# EAGLE design LoRa_final (EAGLE 9.6.2)
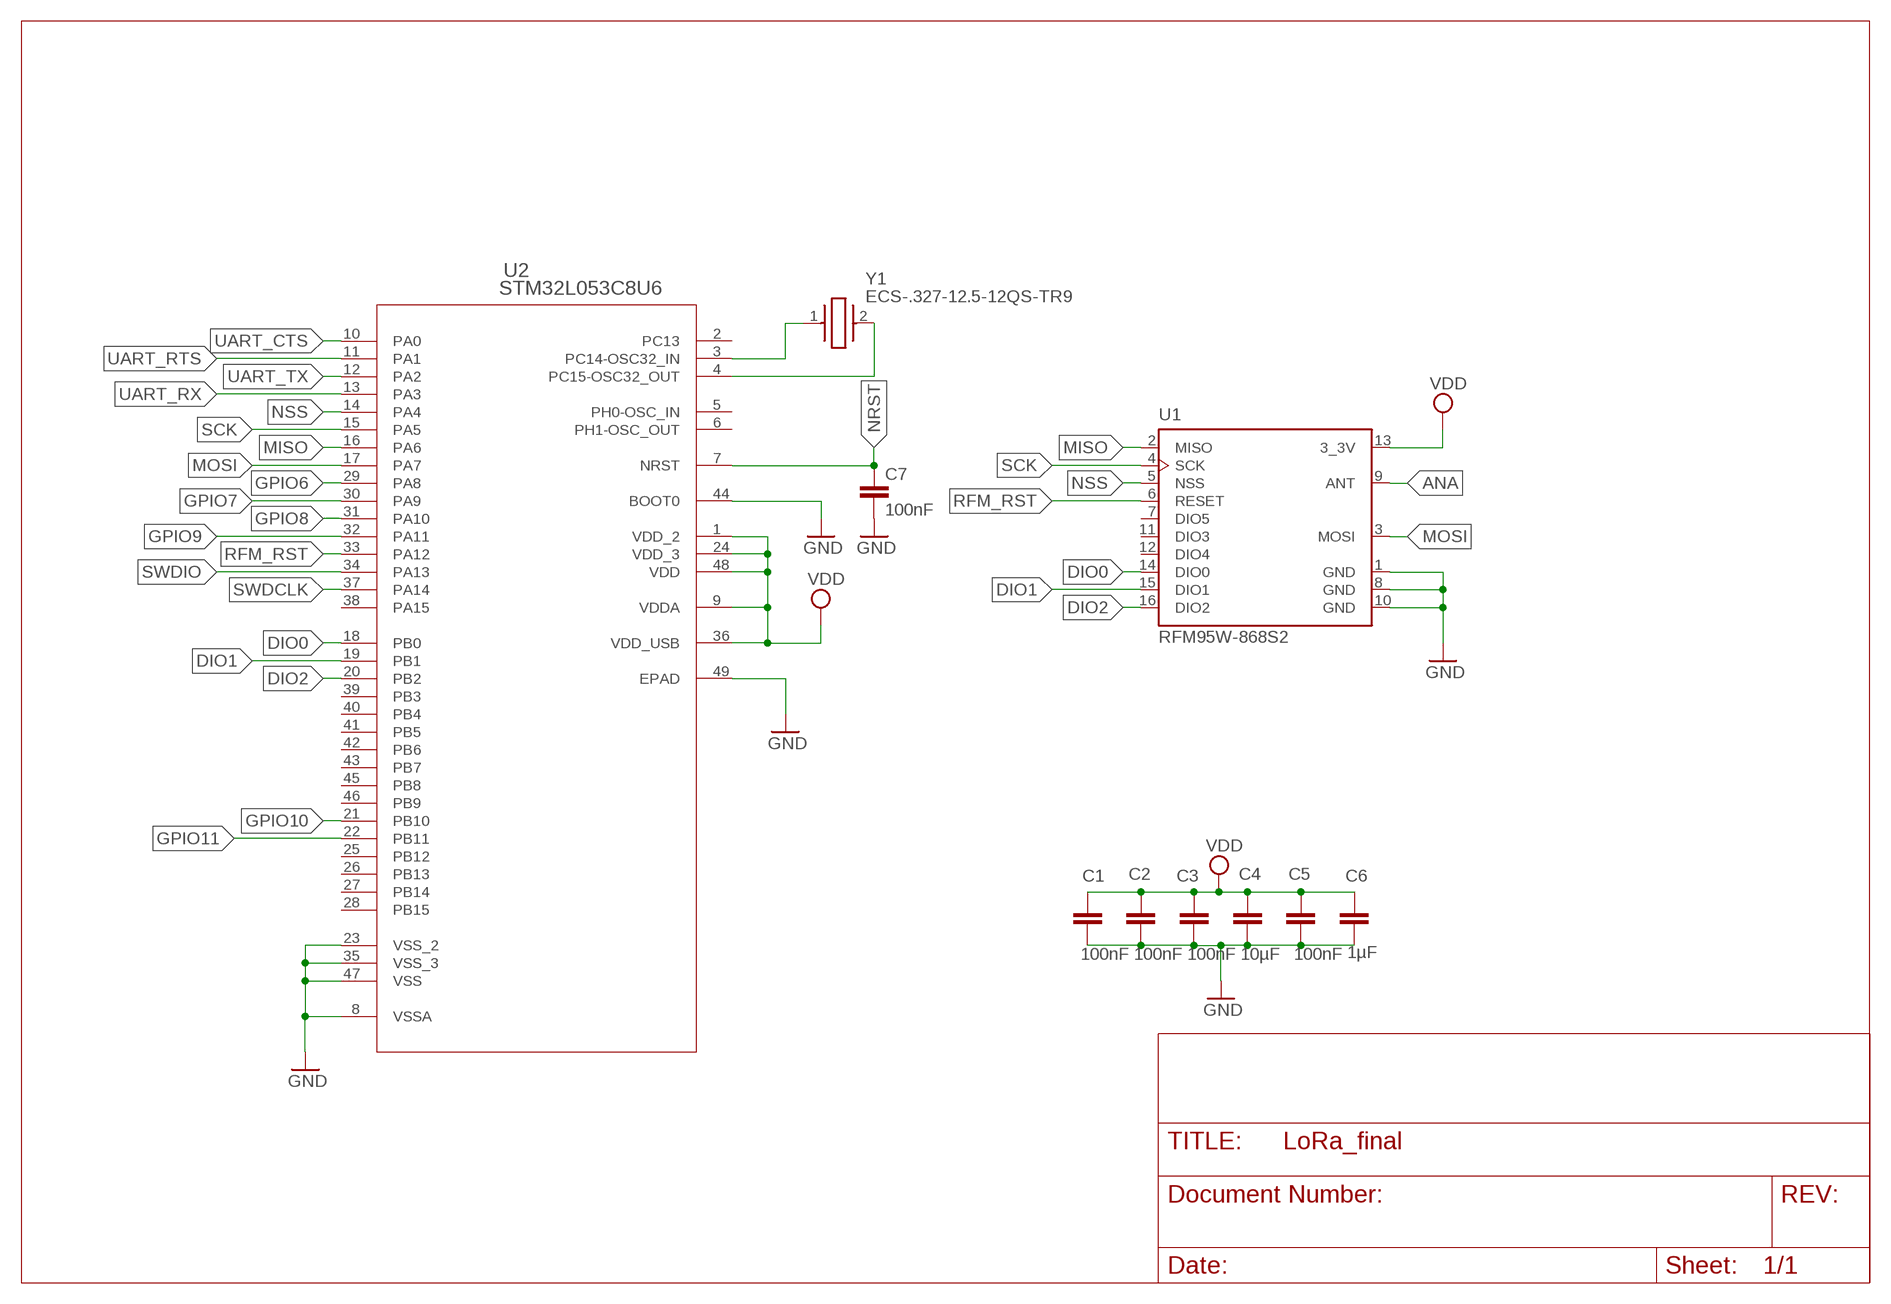
[diagram p0: schematic, sheet 1]

## Parts
C1  100nF  C-EUC0402K  [C0402K]
C2  100nF  C-EUC0402K  [C0402K]
C3  100nF  C-EUC0402K  [C0402K]
C4  10µF  C-EUC0402K  [C0402K]
C5  100nF  C-EUC0402K  [C0402K]
C6  1µF  C-EUC0402K  [C0402K]
C7  100nF  C-EUC0402K  [C0402K]
U1  RFM95W-868S2  [XCVR_RFM95W-868S2]
U2  STM32L053C8U6  [UFQFPN-48_STM]
Y1  ECS-.327-12.5-12QS-TR9  [ECS32712512QSTR9]

## Nets
ANA: U1.9(ANT)
DIO0: U1.14(DIO0) U2.18(PB0)
DIO1: U1.15(DIO1) U2.19(PB1)
DIO2: U1.16(DIO2) U2.20(PB2)
GND: C1.2 C2.2 C3.2 C4.2 C5.2 C6.2 C7.2 U1.1(GND) U1.8(GND) U1.10(GND) U2.8(VSSA) U2.23(VSS_2) U2.35(VSS_3) U2.44(BOOT0) U2.47(VSS) U2.49(EPAD)
GPIO6: U2.29(PA8)
GPIO7: U2.30(PA9)
GPIO8: U2.31(PA10)
GPIO9: U2.32(PA11)
GPIO10: U2.21(PB10)
GPIO11: U2.22(PB11)
MISO: U1.2(MISO) U2.16(PA6)
MOSI: U1.3(MOSI) U2.17(PA7)
N$50: U2.3(PC14-OSC32_IN) Y1.1
N$51: U2.4(PC15-OSC32_OUT) Y1.2
NRST: C7.1 U2.7(NRST)
NSS: U1.5(NSS) U2.14(PA4)
RFM_RST: U1.6(RESET) U2.33(PA12)
SCK: U1.4(SCK) U2.15(PA5)
SWDCLK: U2.37(PA14)
SWDIO: U2.34(PA13)
UART_CTS: U2.10(PA0)
UART_RTS: U2.11(PA1)
UART_RX: U2.13(PA3)
UART_TX: U2.12(PA2)
VDD: C1.1 C2.1 C3.1 C4.1 C5.1 C6.1 U1.13(3_3V) U2.1(VDD_2) U2.9(VDDA) U2.24(VDD_3) U2.36(VDD_USB) U2.48(VDD)
Unconnected: U1.7(DIO5) U1.11(DIO3) U1.12(DIO4) U2.2(PC13) U2.5(PH0-OSC_IN) U2.6(PH1-OSC_OUT) U2.25(PB12) U2.26(PB13) U2.27(PB14) U2.28(PB15) U2.38(PA15) U2.39(PB3) U2.40(PB4) U2.41(PB5) U2.42(PB6) U2.43(PB7) U2.45(PB8) U2.46(PB9)

## Library data of the parts
C1-C7 = rcl:C-EU: CAPACITOR, European symbol; SPICEPREFIX: C
U1 = RFM95W-868S2:RFM95W-868S2: Mod Txrx Lora +20dbm 868mhz Smd Check availability <https://pricing.snapeda.com/parts/RFM95W-868S2/RF/view-part?ref=eda>; AVAILABILITY: In Stock; DESCRIPTION: General ISM < 1GHz LoRa™ Transceiver Module 868MHz Antenna Not Included Surface Mount; MF: RF; MP: RFM95W-868S2; PACKAGE: SMD-16 Hope Microelectronics; PRICE: None; PURCHASE-URL: https://pricing.snapeda.com/search/part/RFM95W-868S2/?ref=eda
U2 = STM32L053C8_seq:STM32L053C8U6; COPYRIGHT: Copyright (C) 2023 Ultra Librarian. All rights reserved.; MANUFACTURER_PART_NUMBER: STM32L053C8U6; MFR_NAME: STMicroelectronics
Y1 = ECS-.327-12.5-12QS-TR9:ECS-.327-12.5-12QS-TR9: Crystals 32.786kHz 12.5pF 20ppm -40C +125C Source: Datasheet <https://ecsxtal.com/store/pdf/ECX-12Q.pdf>; DESCRIPTION: Crystals 32.786kHz 12.5pF 20ppm -40C +125C; HEIGHT: 0.6mm; MANUFACTURER_NAME: ECS; MANUFACTURER_PART_NUMBER: ECS-.327-12.5-12QS-TR9

## Board
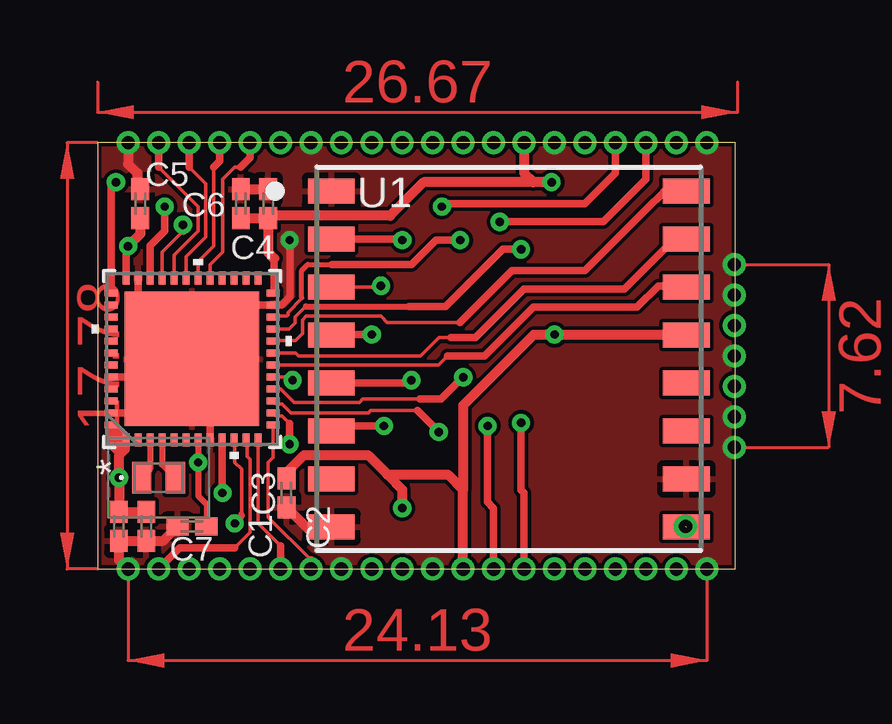
[diagram p1: board, top side]
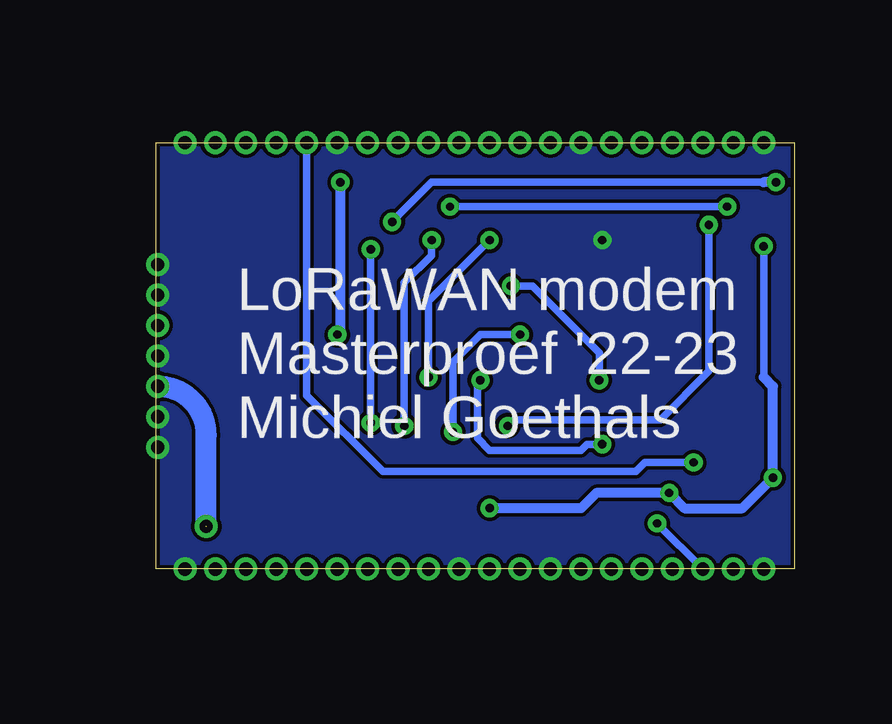
[diagram p2: board, bottom side, seen from below]

Size 26.59 x 17.77 mm. Coordinates in mm from the lower left corner, seen from the top.
Outline: 0,0 26.59,0 26.59,17.77 0,17.77 0,0
Copper layers (1*16): Top 0.035mm / dielectric 1.5mm / Bottom 0.035mm
Design rules "default *": minimum track width 6mil, minimum drill 0.35mm, track to track 6mil, track to pad 6mil, pad to pad 6mil, via to via 6mil, smd to smd 6mil, copper to edge 6mil, drill to drill 6mil, minimum pad ring 10mil, minimum via ring 8mil, stop-mask expansion 4mil, vias tented up to drill 0mil, thermal gap 10mil

### Footprints (pad centres in the part's own frame; a part is rotated, then mirrored left to right if it is on the bottom)
C0402K = smd 0.925 x 0.74: 1 -0.6,0; 2 0.6,0
XCVR_RFM95W-868S2 = smd 1.95 x 1.05: 1 -7.4,7; 2 -7.4,5; 3 -7.4,3; 4 -7.4,1; 5 -7.4,-1; 6 -7.4,-3; 7 -7.4,-5; 8 -7.4,-7; 9 7.4,-7; 10 7.4,-5; 11 7.4,-3; 12 7.4,-1; 13 7.4,1; 14 7.4,3; 15 7.4,5; 16 7.4,7
UFQFPN-48_STM = smd 0.55 x 0.3: 1 -3.375,2.751; 2 -3.375,2.251; 3 -3.375,1.75; 4 -3.375,1.25; 5 -3.375,0.75; 6 -3.375,0.25; 7 -3.375,-0.25; 8 -3.375,-0.75; 9 -3.375,-1.25; 10 -3.375,-1.75; 11 -3.375,-2.251; 12 -3.375,-2.751; 25 3.375,-2.751; 26 3.375,-2.251; 27 3.375,-1.75; 28 3.375,-1.25; 29 3.375,-0.75; 30 3.375,-0.25; 31 3.375,0.25; 32 3.375,0.75; 33 3.375,1.25; 34 3.375,1.75; 35 3.375,2.251; 36 3.375,2.751 | smd 0.3 x 0.55: 13 -2.75,-3.375; 14 -2.25,-3.375; 15 -1.75,-3.375; 16 -1.25,-3.375; 17 -0.75,-3.375; 18 -0.25,-3.375; 19 0.25,-3.375; 20 0.75,-3.375; 21 1.25,-3.375; 22 1.75,-3.375; 23 2.25,-3.375; 24 2.75,-3.375; 37 2.75,3.375; 38 2.25,3.375; 39 1.75,3.375; 40 1.25,3.375; 41 0.75,3.375; 42 0.25,3.375; 43 -0.25,3.375; 44 -0.75,3.375; 45 -1.25,3.375; 46 -1.75,3.375; 47 -2.25,3.375; 48 -2.75,3.375 | smd 5.6 x 5.6: 49 0,0
ECS32712512QSTR9 = smd 0.8 x 1.3: 1 -0.7,0; 2 0.7,0

### Placement (x,y rotation side)
C1  0.89,1.78 270 top
C2  2.03,1.78 270 top
C3  7.87,3.17 270 top
C4  7.11,15.24 90 top
C5  1.78,15.24 90 top
C6  5.97,15.24 90 top
C7  3.94,1.78 180 top
U1  17.14,8.76 0 top
U2  3.94,8.76 90 top
Y1  2.54,3.81 0 top

### Tracks (layer width: path | path; a pad name or v marks a point on that pad's centre or on a via)
ANA  (via drill 0.55)  (1 unrouted)
  Bottom 0.865: v24.51,1.78 24.51,5.59 arc-90 v26.54,7.62
DIO0
  Top 0.152: 14.59,8.89 14.22,8.52 U2.18
  Top 0.305: 14.59,8.89 16.13,8.89 18.16,10.92 22.48,10.92 23.37,11.81 24.5,11.81 U1.14
DIO1
  Top 0.152: U2.19 8.26,9.01 8.38,8.89 13.46,8.89 14.22,9.65 14.73,9.65
  Top 0.305: 14.73,9.65 15.75,9.65 17.78,11.68 18.41,11.68 21.97,11.68 24.05,13.76 U1.15
DIO2
  Top 0.152: U2.20 7.32,9.53 8.26,9.53 8.54,9.81 8.54,10.38 8.7,10.54 11.81,10.54 12.06,10.29 15.11,10.29
  Top 0.305: 15.11,10.29 17.27,12.45 20.32,12.45 22.99,15.11 23.5,15.62 23.64,15.76 U1.16
GND  (via drill 0.35, 0.55, 0.55 pad 0.65)
  Top 0.305: U2.44 3.19,8.01 | U2.47 1.69,6.51 | U2.35 1.69,11.01 | 4.69,9.51 6.19,11.01 U2.23 7.67,11.01 8.02,11.36 8.02,13.7 v8,13.72 | 4.69,9.51 U2.49 | U2.8 4.69,9.51
  Top 0.406: U1.8 9.74,1.69 8.76,1.69 C3.2 | 3.19,8.01 U2.49 | 1.69,6.51 U2.49 | 1.69,11.01 U2.49 | 4.95,8.76 U2.49 | C6.2 C4.2 | C7.2 2.74,1.18 C2.2 C1.2 0.89,0.38 v1.27,0 | C5.2 1.65,15.97 1.65,16.51 1.27,16.89 v1.27,17.78
  other vias: 10.16,0 13.97,0 25.4,0 26.54,5.08 26.54,6.35 26.54,8.89 26.54,11.43 26.54,12.7 25.4,17.78 19.05,17.78 8.89,17.78
  pour Bottom: 0,0 26.54,0 26.54,17.78 0,17.78
  pour Top: 0,17.78 0,0 26.54,0 26.54,17.78
GPIO6  (via drill 0.55)
  Top 0.152: U2.29 4.69,12.69 5.21,13.21 5.21,16.26 5.71,16.76 5.97,16.76
  Top 0.305: v6.35,17.78 6.35,17.14 5.97,16.76
GPIO7  (via drill 0.55)
  Top 0.152: U2.30 4.19,12.82 4.83,13.46 4.83,16.76
  Top 0.305: v5.08,17.78 5.08,17.02 4.83,16.76
GPIO8  (via drill 0.55)
  Top 0.152: U2.31 3.69,13.04 4.5,13.84 4.5,16.08 3.81,16.76
  Top 0.305: v3.81,17.78 3.81,16.76
GPIO9  (via drill 0.55)
  Top 0.152: U2.32 3.19,13.09 4.19,14.1 4.19,15.11 2.54,16.76
  Top 0.305: v2.54,17.78 2.54,16.76
GPIO10  (via drill 0.35, 0.55)
  Top 0.152: U2.21 7.98,10.01 8.24,10.27 8.24,10.51 8.68,10.95
  Top 0.254: 8.68,10.95 12.98,10.95
  Top 0.305: 12.98,10.95 14.5,10.95 16.89,13.34 v17.65,13.34 | v17.65,6.1 17.65,3.3 17.78,3.17 v17.78,0
  Bottom 0.305: v17.65,13.34 v17.65,6.1
GPIO11  (via drill 0.35, 0.55)
  Top 0.152: U2.22 7.34,10.54 7.87,10.54 7.93,10.6 7.93,10.71 8.51,11.28 8.51,11.31
  Top 0.203: 8.51,11.31 8.51,12.45 8.76,12.7 9.78,12.7
  Top 0.305: v15.11,13.72 14.1,13.72 13.08,12.7 9.78,12.7 | v16.51,0 16.51,2.54 16.26,2.79 v16.26,5.97
  Bottom 0.305: v15.11,13.72 15.11,13.08 16.26,11.94 v16.26,5.97
GPIO12  (via drill 0.55)
  other vias: 12.7,0
GPIO13  (via drill 0.55)
  other vias: 11.43,0
MISO  (via drill 0.35)
  Top 0.152: 13.43,7.08 11.05,7.08 10.92,6.95 8.2,6.95 7.63,7.51 U2.16
  Top 0.305: U1.2 12.65,13.76 v12.7,13.72 | 13.43,7.08 14.32,7.08 v15.24,8
  Bottom 0.305: v12.7,13.72 15.24,11.18 v15.24,8
MOSI  (via drill 0.35)
  Top 0.152: U2.17 7.99,8.01 v8.13,7.87 | v11.81,11.81 11.76,11.76 U1.3
  Bottom 0.305: v11.81,11.81 10.92,11.81 8.13,9.02 v8.13,7.87
N$1  (via drill 0.55)
  other vias: 16.51,17.78
N$2  (via drill 0.55)
  other vias: 26.54,10.16
N$3  (via drill 0.55)
  other vias: 15.24,17.78
N$4  (via drill 0.55)
  other vias: 13.97,17.78
N$5  (via drill 0.55)
  other vias: 12.7,17.78
N$6  (via drill 0.55)
  other vias: 11.43,17.78
N$7  (via drill 0.55)
  other vias: 10.16,17.78
N$11  (via drill 0.55)
  other vias: 24.13,0
N$12  (via drill 0.55)
  other vias: 21.59,0
N$13  (via drill 0.55)
  other vias: 22.86,0
N$14  (via drill 0.55)
  other vias: 20.32,0
N$15  (via drill 0.55)
  other vias: 19.05,0
N$25  (via drill 0.55)
  other vias: 6.35,0
N$26  (via drill 0.55)
  other vias: 5.08,0
N$31  (via drill 0.55)
  other vias: 24.13,17.78
N$44  (via drill 0.55)
  other vias: 7.62,17.78
N$50
  Top 0.254: U2.3 2.19,4.16 Y1.1
N$51
  Top 0.254: U2.4 2.69,4.36 Y1.2
NRST  (via drill 0.35, 0.55)
  Top 0.152: v4.19,4.45
  Top 0.254: U2.7 v4.19,4.45 | v4.19,4.45 4.19,3.05 4.54,2.7 C7.1
  Bottom 0.305: v20.32,17.78 20.32,7.24 17.14,4.06 6.6,4.06 6.22,4.45 v4.19,4.45
NSS  (via drill 0.35)
  Top 0.152: U2.14 7.43,6.39 7.68,6.39 8,6.07
  Top 0.305: v8,5.21 8,6.07 | U1.5 12.97,7.76 v13.08,7.87
  Bottom 0.305: v13.08,7.87 13.21,7.75 13.21,5.46 12.7,4.95 8.89,4.95 8.64,5.21 v8,5.21
RFM_RST  (via drill 0.35)
  Top 0.152: U2.33 2.69,13.23 3.56,14.1
  Top 0.305: U1.6 9.95,5.97 v11.94,5.97 | v3.56,14.35 3.56,14.1
  Bottom 0.305: v11.94,5.97 11.68,6.22 5.59,6.22 3.56,8.26 v3.56,14.35
SCK  (via drill 0.35)
  Top 0.152: U2.15 7.43,6.89 7.68,6.89 8.06,6.52 11.3,6.52 11.38,6.6 13.34,6.6
  Top 0.305: v11.43,9.78 9.76,9.78 U1.4 | 13.34,6.6 v14.22,5.71
  Bottom 0.305: v11.43,9.78 13.08,9.78 14.22,8.64 v14.22,5.71
SWDCLK  (via drill 0.35, 0.55)
  Top 0.305: U2.37 0.56,15.93 v0.76,16.13 | v22.86,17.78 22.86,16.26 21.08,14.48 v16.76,14.48
  Bottom 0.305: v16.76,14.48 15.11,16.13 1.27,16.13
  Bottom 0.406: v0.76,16.13 1.27,16.13
SWDIO  (via drill 0.35, 0.55)
  Top 0.305: U2.34 2.19,13.49 2.79,14.1 v2.79,15.11 | v21.59,17.78 21.59,16.51 20.32,15.24 14.48,15.24 v14.35,15.11
  Bottom 0.305: v2.79,15.11 v14.35,15.11
UART_CTS  (via drill 0.35, 0.55)
  Top 0.152: U2.10 5.71,5.36 5.71,4.45 5.99,4.17 5.99,2.29
  Top 0.254: v5.71,1.91 5.99,2.18 5.99,2.29
  Bottom 0.305: v3.81,0 v5.71,1.91
UART_RTS  (via drill 0.55)
  Top 0.152: U2.11 6.22,5.35 6.22,4.7 6.35,4.57 6.35,1.52 5.71,0.89
  Top 0.305: v2.54,0 3.43,0.89 5.71,0.89
UART_RX  (via drill 0.55)
  Top 0.152: U2.13 7.31,4.64 7.11,4.45 7.11,2.16 8.89,0.38
  Top 0.305: v8.89,0 8.89,0.38
UART_TX  (via drill 0.55)
  Top 0.152: U2.12 6.69,1.9 7.62,0.96
  Top 0.305: v7.62,0 7.62,0.96
VDD  (via drill 0.35, 0.55)
  Top 0.305: 7.37,12.95 7.37,11.57 U2.24 | v5.21,3.17 5.19,3.15 U2.9 | U2.36 1.19,13.38 v1.27,13.46 | 0.89,5.68 U2.1 1.19,5 0.89,4.7 0.89,4.83 | 0.89,5.68 0.75,5.83 | 0.75,5.83 U2.48 0.56,5.33 | 0.89,4.83 0.89,5.68 | 0.56,5.33 0.56,5.15 0.89,4.83 | 0.75,5.83 0.75,5.52 0.56,5.33
  Top 0.406: U1.13 19.07,9.76 | 19.07,9.76 18.18,9.76 15.24,6.83 15.24,3.3 | 19.07,9.76 v19.05,9.78 | v17.78,17.78 17.78,16.51 18.16,16.13 v18.92,16.13 13.59,16.13 12.19,14.73 7.2,14.73 C4.1 | 12.08,3.94 11.26,4.75 8.89,4.75 8.61,4.75 7.87,4.02 C3.1 | 15.24,3.3 14.61,3.94 12.08,3.94 | v15.24,0 15.24,3.3 | 0.89,4.7 v0.89,3.81 C1.1 C2.1 | v1.27,13.46 1.78,13.97 C5.1 | C6.1 C4.1 | C4.1 7.11,13.21 7.37,12.95 | 12.08,3.94 12.7,3.32 v12.7,2.54
  Bottom 0.305: v1.27,13.46 1.27,8
  Bottom 0.406: v18.92,16.13 18.92,9.91 v19.05,9.78 | 1.27,8 0.89,7.62 v0.89,3.81 2.16,2.54 4.57,2.54 v5.21,3.17 8.26,3.17 8.89,2.54 v12.7,2.54
(copper drawn outside any net)
  shapes: Top area x4

### Text on the board
bNames: LoRaWAN modem / Masterproef '22-23 / Michiel Goethals